# EAGLE design PCB_buttons (EAGLE 8.0.1)
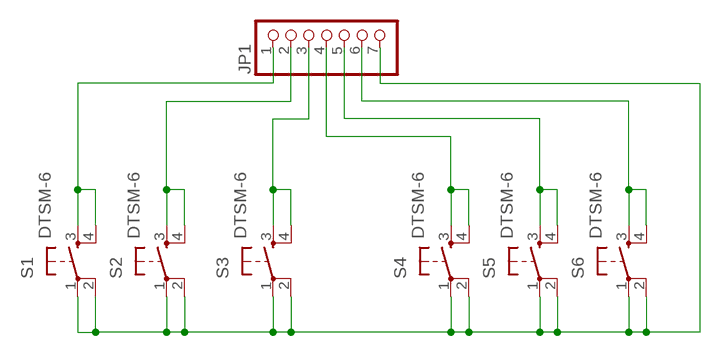
[diagram p0: schematic, sheet 1]

## Parts
JP1  PINHD-1X7  [1X07]
S1  DTSM-6  [DTSM-6]
S2  DTSM-6  [DTSM-6]
S3  DTSM-6  [DTSM-6]
S4  DTSM-6  [DTSM-6]
S5  DTSM-6  [DTSM-6]
S6  DTSM-6  [DTSM-6]

## Nets
N$1: JP1.7 S1.1 S1.2 S2.1 S2.2 S3.1 S3.2 S4.1 S4.2 S5.1 S5.2 S6.1 S6.2
N$3: JP1.6 S6.3 S6.4
N$4: JP1.5 S5.3 S5.4
N$5: JP1.4 S4.3 S4.4
N$6: JP1.3 S3.3 S3.4
N$7: JP1.2 S2.3 S2.4
N$8: JP1.1 S1.3 S1.4

## Library data of the parts
JP1 = pinhead:PINHD-1X7: PIN HEADER
S1-S6 = switch-tact:DTSM-6

## Board
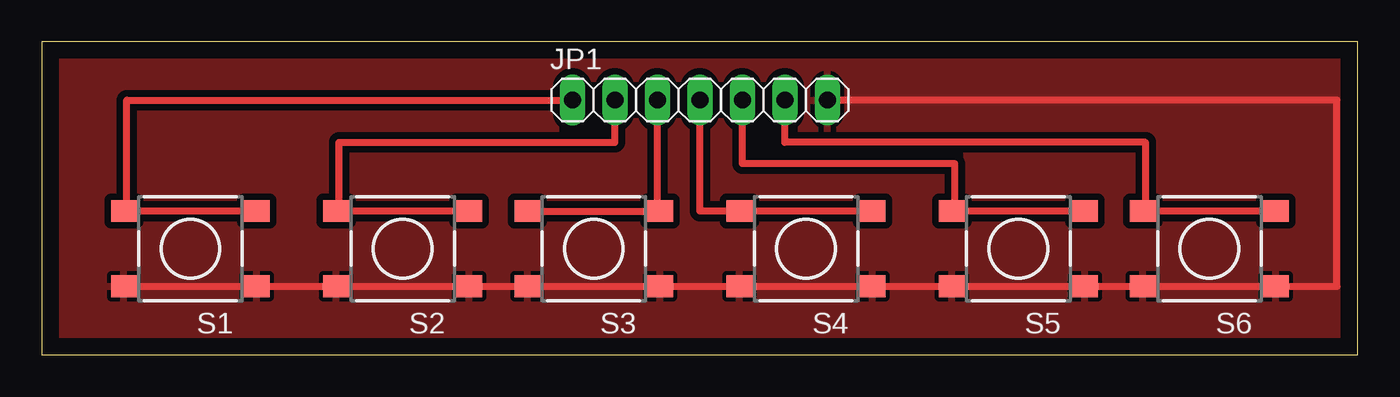
[diagram p1: board, top side]

Size 78.72 x 18.72 mm. Coordinates in mm from the lower left corner, seen from the top.
Outline: 0,0 78.72,0 78.72,18.72 0,18.72 0,0
Copper layers (1*16): Top 0.035mm / dielectric 1.5mm / Bottom 0.035mm
Design rules "default": minimum track width 10mil, minimum drill 24mil, track to track 8mil, track to pad 8mil, pad to pad 8mil, via to via 8mil, smd to smd 8mil, copper to edge 40mil, drill to drill 8mil, minimum pad ring 10mil, minimum via ring 8mil, stop-mask expansion 4mil, vias tented up to drill 0mil, thermal gap 10mil

### Footprints (pad centres in the part's own frame; a part is rotated, then mirrored left to right if it is on the bottom)
1X07 = drill 1.016 long: 1 -7.62,0; 2 -5.08,0; 3 -2.54,0; 4 0,0; 5 2.54,0; 6 5.08,0; 7 7.62,0
DTSM-6 = smd 1.55 x 1.3: 1 -3.975,2.25; 2 3.975,2.25; 3 -3.975,-2.25; 4 3.975,-2.25

### Placement (x,y rotation side)
JP1  39.37,15.24 0 top
S1  8.89,6.35 180 top
S2  21.59,6.35 180 top
S3  33.02,6.35 180 top
S4  45.72,6.35 180 top
S5  58.42,6.35 180 top
S6  69.85,6.35 180 top

### Tracks (layer width: path | path; a pad name or v marks a point on that pad's centre or on a via)
N$1
  Top 0.406: S1.2 S1.1 S2.2 S2.1 S3.2 S3.1 S4.2 S4.1 S5.2 S5.1 S6.2 S6.1 77.47,4.1 77.47,15.24 JP1.7
  pour Top (isolate 0.406): 0.26,18.51 78.81,18.51 78.81,0.11 0.11,0.11 0.11,18.61
N$3
  Top 0.406: S6.3 S6.4 66.04,8.6 66.04,12.7 44.45,12.7 JP1.6
N$4
  Top 0.406: S5.3 S5.4 54.61,8.6 54.61,11.43 41.91,11.43 JP1.5
N$5
  Top 0.406: S4.3 S4.4 39.37,8.6 JP1.4
N$6
  Top 0.406: JP1.3 36.83,8.6 S3.3 S3.4
N$7
  Top 0.406: S2.3 S2.4 17.78,8.6 17.78,12.7 34.29,12.7 JP1.2
N$8
  Top 0.406: S1.3 S1.4 5.08,8.6 5.08,15.24 JP1.1